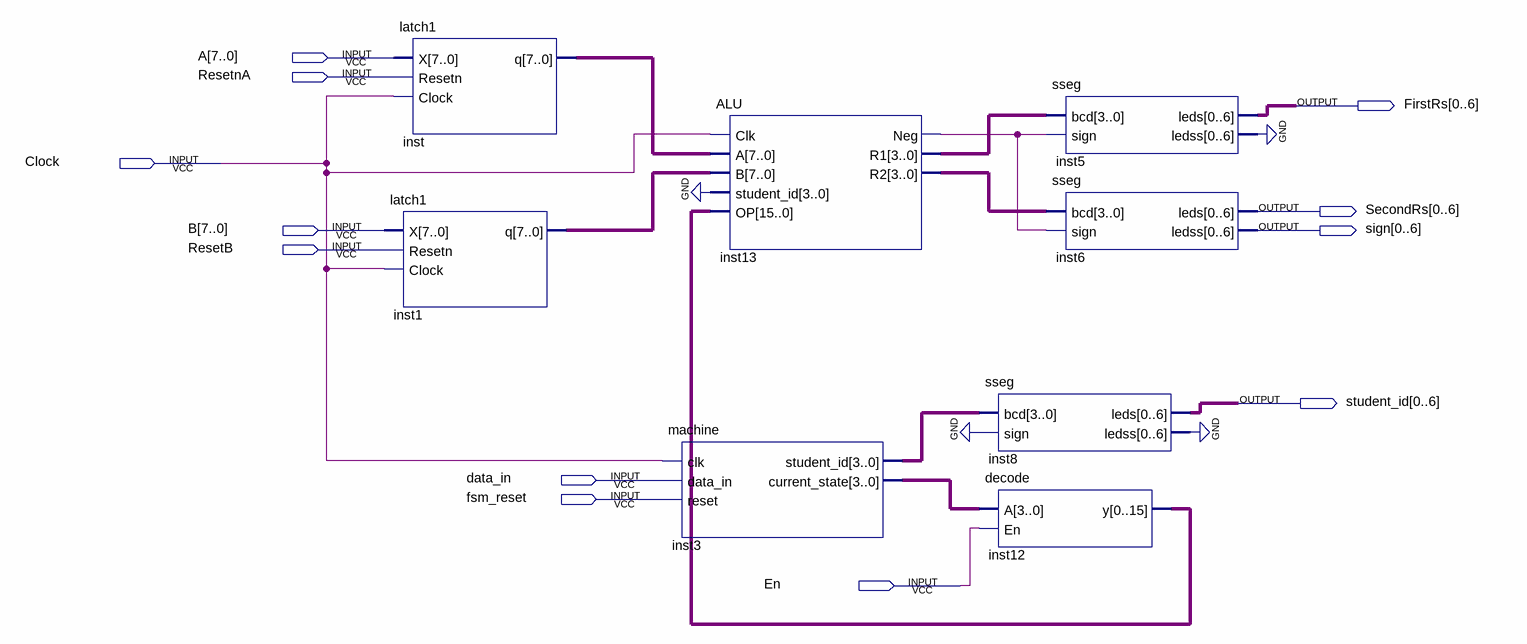
[diagram p0: schematic sheet]
// Quartus schematic problem1.bdf as structural Verilog: 8 symbols, 12 pins
module problem1 (
  input  [7:0] A,
  input  ResetnA,
  input  Clock,
  input  [7:0] B,
  input  ResetB,
  input  data_in,
  input  fsm_reset,
  input  En,
  output [0:6] FirstRs,
  output [0:6] SecondRs,
  output [0:6] sign,
  output [0:6] student_id
);

  wire inst13_neg;
  wire [3:0] inst3_current_state, inst3_student_id, inst13_r1, inst13_r2;
  wire [6:0] inst5_ledss, inst8_ledss;
  wire [7:0] inst1_q, inst_q;
  wire [15:0] inst12_y;

  latch1 inst (.X(A), .Resetn(ResetnA), .Clock(Clock), .q(inst_q));
  latch1 inst1 (.X(B), .Resetn(ResetB), .Clock(Clock), .q(inst1_q));
  machine inst3 (
    .clk(Clock), .data_in(data_in), .reset(fsm_reset), .student_id(inst3_student_id),
    .current_state(inst3_current_state));
  ALU inst13 (
    .Clk(Clock), .A(inst_q), .B(inst1_q), .student_id(4'b0000), .OP(inst12_y), .Neg(inst13_neg),
    .R1(inst13_r1), .R2(inst13_r2));
  sseg inst8 (.bcd(inst3_student_id), .sign(1'b0), .leds(student_id), .ledss(inst8_ledss));
  decode inst12 (.A(inst3_current_state), .En(En), .y(inst12_y));
  sseg inst5 (.bcd(inst13_r1), .sign(inst13_neg), .leds(FirstRs), .ledss(inst5_ledss));
  sseg inst6 (.bcd(inst13_r2), .sign(inst13_neg), .leds(SecondRs), .ledss(sign));
  // also tied to GND on the sheet: {inst8_ledss[0], inst8_ledss[1], inst8_ledss[2], inst8_ledss[3], inst8_ledss[4], inst8_ledss[5], inst8_ledss[6], inst5_ledss[0], inst5_ledss[1], inst5_ledss[2], inst5_ledss[3], inst5_ledss[4], inst5_ledss[5], inst5_ledss[6]}
endmodule
